# Altium project Power Supply.PrjPcb
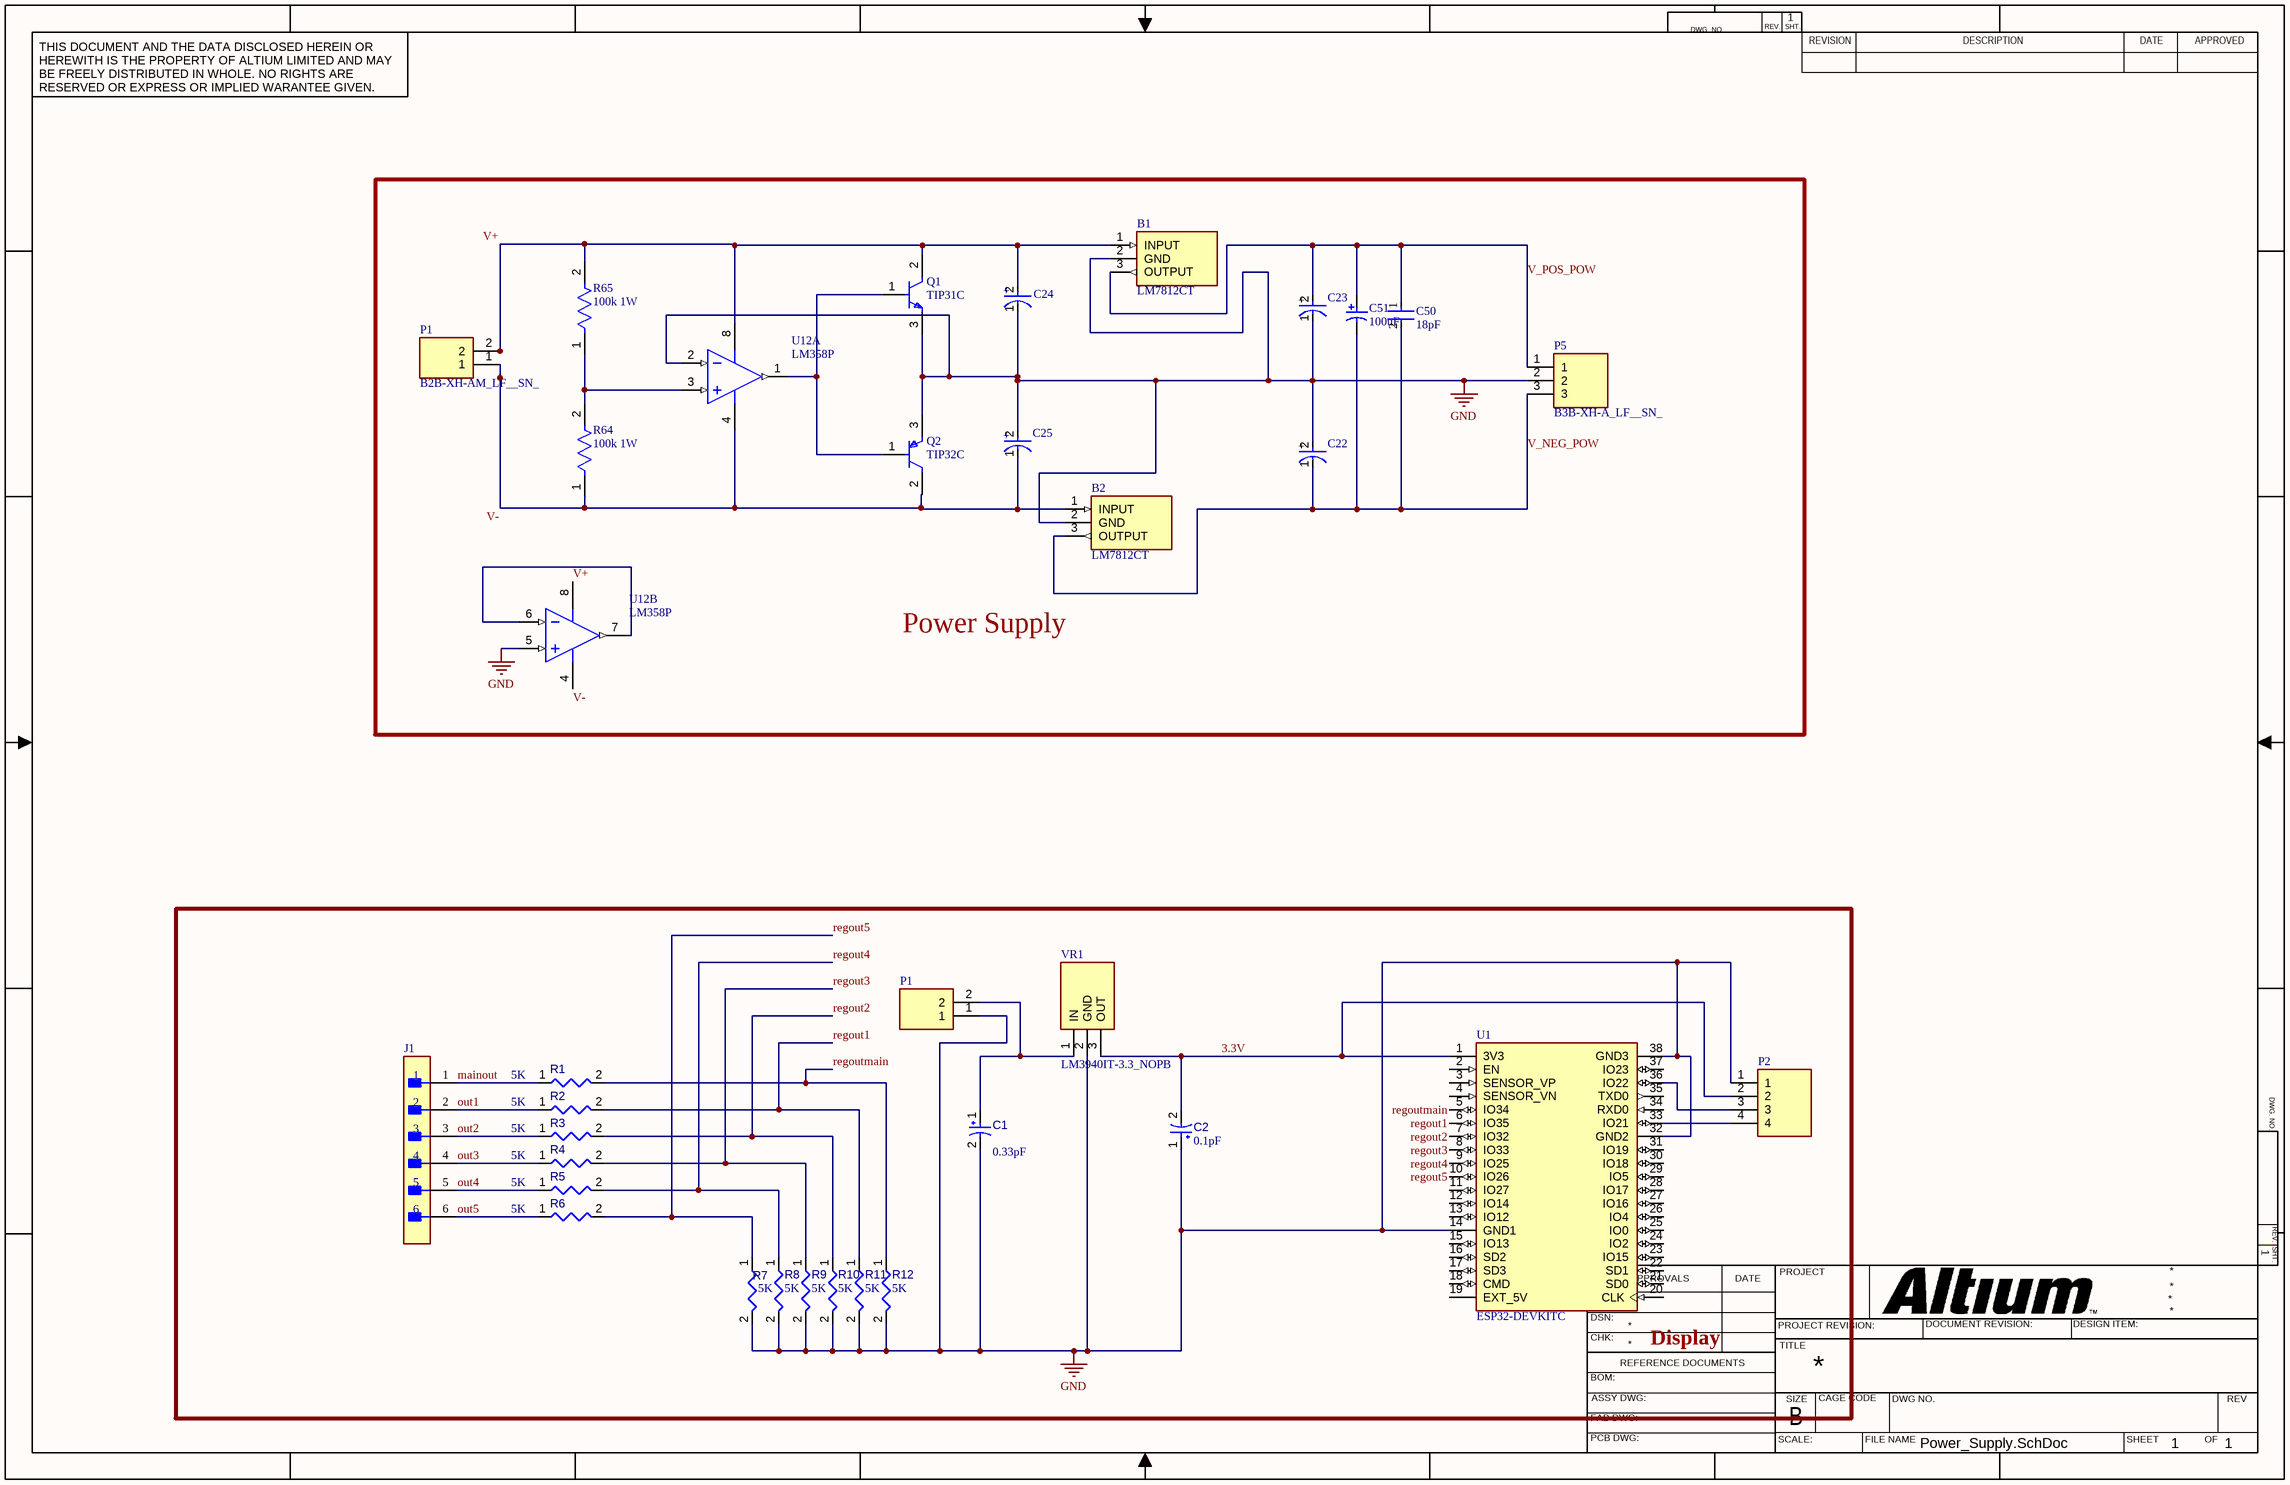
[diagram p0: Power_Supply.SchDoc]
1 sheet, 34 parts. Net scope: global (net labels, ports and power ports of the same name join across sheets).
Board file: PCB2.PcbDoc

## Sheet Power_Supply.SchDoc
size 431 x 279 mm; SheetNumber: 1; SheetTotal: 1

### Parts
(Parts that share a designator on the sheet are numbered #1, #2 ... from top to bottom, then left to right.)
B1  LM7812CT  [TO254P470X1028X1955-3P]
B2  LM7812CT  [TO254P470X1028X1955-3P]
C1  value 0.33pF  [CAPPR55-250-1120X630X1220]
C2  value 0.1pF  [CAPPR55-250-1120X630X1220]
C22  EEUFC1H4R7B  [FP-RAD-TH-D_5_0_5-L_11_1-MFG]  (value not drawn)
C23  EEUFC1H4R7B  [FP-RAD-TH-D_5_0_5-L_11_1-MFG]  (value not drawn)
C24  EEUFC1H4R7B  [FP-RAD-TH-D_5_0_5-L_11_1-MFG]  (value not drawn)
C25  EEUFC1H4R7B  [FP-RAD-TH-D_5_0_5-L_11_1-MFG]  (value not drawn)
C50  18pF  [FP-F471K33Y5RP6UK5R-MFG]
C51  100uF  [CAPPR65-350-1150X800X1250]
J1  B6B-XH-A(LF)(SN)  [FP-B6B-XH-A_LF_SN-MFG]  (value not drawn)
P1#1  B2B-XH-AM_LF__SN_  [B2BXHAMLFSN]
P1#2  B2B-XH-AM_LF__SN_  [B2BXHAMLFSN]  (value not drawn)
P2  (no value)  [B4BXHALFSN]
P5  B3B-XH-A_LF__SN_  [B3BXHALFSN]
Q1  TIP31C  [FP-TO-220-P0A0015988-MFG]
Q2  TIP32C  [FP-TO-220-P0A0015988-MFG]
R1  value 5K  [RESA60-630X240]  (hidden comment: MFR-25FBF52-221R)
R2  value 5K  [RESA60-630X240]  (hidden comment: MFR-25FBF52-221R)
R3  value 5K  [RESA60-630X240]  (hidden comment: MFR-25FBF52-221R)
R4  value 5K  [RESA60-630X240]  (hidden comment: MFR-25FBF52-221R)
R5  value 5K  [RESA60-630X240]  (hidden comment: MFR-25FBF52-221R)
R6  value 5K  [RESA60-630X240]  (hidden comment: MFR-25FBF52-221R)
R7  value 5K  [RESA60-630X240]  (hidden comment: MFR-25FBF52-221R)
R8  value 5K  [RESA60-630X240]  (hidden comment: MFR-25FBF52-221R)
R9  value 5K  [RESA60-630X240]  (hidden comment: MFR-25FBF52-221R)
R10  value 5K  [RESA60-630X240]  (hidden comment: MFR-25FBF52-221R)
R11  value 5K  [RESA60-630X240]  (hidden comment: MFR-25FBF52-221R)
R12  value 5K  [RESA60-630X240]  (hidden comment: MFR-25FBF52-221R)
R64  100k 1W  [FP-RR01-MFG]
R65  100k 1W  [FP-RR01-MFG]
U1  ESP32-DEVKITC  [MODULE_ESP32-DEVKITC]
U12  LM358P  [P0008A]  (parts A,B of 2)
VR1  LM3940IT-3.3_NOPB  [TO254P470X1028X1955-3P]

### Blocks framed on the sheet
Power Supply: B1 B2 C22-C25 C50 C51 P1#1 P5 Q1 Q2 R64 R65 U12
Display: C1 C2 J1 P1#2 P2 R1-R12 U1 VR1

### Nets
GND: B1.2(GND) B2.2(GND) C1.2 C2.1 C22.2(A) C23.1(C) C24.1(C) C25.2(A) P1#2.1 P2.1 P5.2 Q1.3(E) Q2.3(E) R7.2 R8.2 R9.2 R10.2 R11.2 R12.2 U1.14(GND1) U1.32(GND2) U1.38(GND3) U12.2(1IN-) U12.5(2IN+) VR1.2(GND)
3.3V: C2.2 P2.2 U1.1(3V3) VR1.3(OUT)
mainout: J1.1 R1.1
out1: J1.2 R2.1
out2: J1.3 R3.1
out3: J1.4 R4.1
out4: J1.5 R5.1
out5: J1.6 R6.1
regout1: R2.2 R11.1 U1.6(IO35)
regout2: R3.2 R10.1 U1.7(IO32)
regout3: R4.2 R9.1 U1.8(IO33)
regout4: R5.2 R8.1 U1.9(IO25)
regout5: R6.2 R7.1 U1.10(IO26)
regoutmain: R1.2 R12.1 U1.5(IO34)
V+: B1.1(INPUT) C24.2(A) P1#1.2 Q1.2(C) R65.2 U12.8(VCC)
V-: B2.1(INPUT) C25.1(C) P1#1.1 Q2.2(C) R64.1 U12.4(GND)
V_NEG_POW: B2.3(OUTPUT) C22.1(C) C50.2 C51.2 P5.3
V_POS_POW: B1.3(OUTPUT) C23.2(A) C50.1 C51.1 P5.1
NetC1_1: C1.1 P1#2.2 VR1.1(IN)
NetP2_3: P2.3 U1.36(IO22)
NetP2_4: P2.4 U1.33(IO21)
NetQ1_1: Q1.1(B) Q2.1(B) U12.1(1OUT)
NetR64_2: R64.2 R65.1 U12.3(1IN+)
NetU12_6: U12.6(2IN-) U12.7(2OUT)

Not connected (* = marked no-connect by the designer): U1 2(EN) 3(SENSOR_VP) 4(SENSOR_VN) 11(IO27) 12(IO14) 13(IO12) 15(IO13) 16(SD2) 17(SD3) 18(CMD) 19(EXT_5V) 20(CLK) 21(SD0) 22(SD1) 23(IO15) 24(IO2) 25(IO0) 26(IO4) 27(IO16) 28(IO17) 29(IO5) 30(IO18) 31(IO19) 34(RXD0) 35(TXD0) 37(IO23)

### Notes on the sheet
- DWG. NO.
- REV.
- SHT.
- THIS DOCUMENT AND THE DATA DISCLOSED HEREIN OR HEREWITH IS THE PROPERTY OF ALTIUM LIMITED AND MAY BE FREELY DISTRIBUTED IN WHOLE. NO RIGHTS ARE RESERVED OR EXPRESS OR IMPLIED WARANTEE GIVEN.
- REVISION
- DESCRIPTION
- DATE
- APPROVED
- ENG:
- APPROVALS
- PROJECT
- DSN:
- CHK:
- REFERENCE DOCUMENTS
- PROJECT REVISION:
- TITLE
- DOCUMENT REVISION:
- DESIGN ITEM:
- BOM:
- FAB DWG:
- PCB DWG:
- ASSY DWG:
- SCALE:
- SIZE
- B
- CAGE CODE
- FILE NAME
- DWG NO.
- SHEET
- OF
- REV
- (in symbol CMP-05427-000609-1) +

### Library data of the parts
B1 B2 = LM7812CT: Integrated Circuit; Manufacturer_Name: Texas Instruments; Datasheet Link: http://www.ti.com/lit/ds/symlink/lm7800.pdf; Height: 4.7mm; Manufacturer_Part_Number: LM7812CT; Mouser Part Number: 926-LM7812CT; Mouser Price/Stock: https://www.mouser.co.uk/ProductDetail/Texas-Instruments/LM7812CT?qs=QbsRYf82W3EQj7KGft8TFg%3D%3D
C1 C2 = CMP-001-00031-7: Aluminum Electrolytic Capacitor, 47 uF, +/-20%, 50 V, -40 to 85 degC, 2-Pin THD, RoHS, Bulk; Manufacturer: Panasonic; Ripple Current: 130mA; Voltage Rating: 50V; Tolerance: 20%; RoHS Compliant: True; Lead Pitch: 2.5mm; Packaging: Bulk; Case/Package: Radial; Diameter: 6.3mm; Datasheet Version: Apr-16; Mounting Technology: TH; Max Operating Temperature: 85°C; Package Quantity: 200; Package Description: 2-Pin Radial Lead, Dia 6.3 mm, Height 12.2 mm; Capacitor Type: Electrolytic; Min Operating Temperature: -40°C; Ripple Current (AC): 130mA; Manufacturer URL: http://www.panasonic.com/; Pins: 2; Datasheet URL: https://industrial.panasonic.com/cdbs/www-data/pdf/RDF0000/DMF0000COL72.pdf; Package Reference: CAPPR55-250-1120X630X1220
C22-C25 = CMP-05427-000609-1: Aluminum Electrolytic Capacitors (Radial Lead Type) AEC-Q200 Qualified 4.7uF ±20% 50V; Impedance: 1.3R; Life (Hours): 1000Hour; Polarity: Polar; Lead Diameter: 0.5mm; Ripple Current: 95mA; Ratings: AEC-Q200; Voltage Rating (DC): 50V; Voltage Rating: 50V; Lead Pitch: 5mm; Features: General Purpose; Height: 11mm; Radiation Hardening: No; Diameter: 5mm; Termination: Radial; Length: 11mm; Min Operating Temperature: -55°C; Height - Seated (Max): 0.472inch; Packaging: Tape and Reel; Max Operating Temperature: 105°C; ESR (Equivalent Series Resistance): 1.3R; RoHS Compliant: Yes; Package Quantity: 2000; Mount: Through Hole; Tolerance: 20%; Series: FC; Case/Package: Radial; Contact Plating: Tin
C50 = CMP-02417-000080-1: CAP CER 470PF 2KV Y5R RADIAL; Tolerance: 10%; Dielectric Material: Ceramic; Insulation Resistance: 10GR; Lead/Base Style: Kinked; Lead Diameter: 0.8mm; Series: F; Depth: 5mm; Package Quantity: 1500; Resistor Type: Ceramic; Construction: RADIAL; Min Operating Temperature: -30°C; Mount: Through Hole; Radiation Hardening: No; Voltage: 2kV; Voltage Rating: 2kV; Max Operating Temperature: 125°C; Termination: Radial; RoHS Compliant: Yes; Lead Pitch: 5mm; Capacitance: 470pF; Packaging: Tape and Reel; Length: 8.5mm; Case/Package: Radial; Dielectric: Y5R
C51 = CMP-1665-00042-2: Aluminum Electrolytic Capacitor, 100 uF, +/- 20%, 50 V, -40 to 85 degC, 2-Pin THD, RoHS, Bulk; Manufacturer: Panasonic; Lead Diameter: 0.6mm; Dielectric Material: Aluminium; Voltage Rating (DC): 50V; Ripple Current (AC): 250mA; Polarity: Polar; Leakage Current: 3uA; Life (Hours): 2000Hour; Lead/Base Style: Straight; Dissipation Factor: 0.12%; Radiation Hardening: No; Height: 11.5mm; Package Quantity: 200; Package Reference: CAPPR65-350-1150X800X1250; Min Operating Temperature: -40degC; Mount: ThroughHole; Package Description: 2-Pin Radial Lead, Dia 8 mm, Height 12.5 mm; Case/Package: Radial; Diameter: 8mm; Voltage Rating: 50V; Length: 11.5mm; REACH SVHC: NoSVHC; Height - Seated (Max): 0.492inch; Datasheet URL: https://industrial.panasonic.com/cdbs/www-data/pdf/RDF0000/ABA0000C1218.pdf; RoHSCompliant: true; Ripple Current: 250mA; Lead Free: LeadFree; Voltage: 50V; Manufacturer URL: http://www.panasonic.com/; Number of Pins: 2; Datasheet Version: Rev. 05, 10/2016; Packaging: Bulk; Termination: Radial; Max Operating Temperature: 85degC; Tolerance: 20%; Capacitance: 100uF; Lead Pitch: 3.5mm
J1 = CMP-17439-000076-1: CONN HEADER VERT 6POS 2.5MM
P1#1 P1#2 = B2B-XH-AM_LF__SN_: Connector; Manufacturer_Name: JST (JAPAN SOLDERLESS TERMINALS); Manufacturer_Part_Number: B2B-XH-AM(LF)(SN); Datasheet Link: https://www.jst-mfg.com/product/pdf/eng/eXH.pdf; Height: 7mm; Arrow Part Number: B2B-XH-AM(LF)(SN); Arrow Price/Stock: https://www.arrow.com/en/products/b2b-xh-am-lf-sn/jst-manufacturing?region=europe
P2 = B4B-XH-A_LF__SN_: Connector; Manufacturer_Name: JST (JAPAN SOLDERLESS TERMINALS); Manufacturer_Part_Number: B4B-XH-A(LF)(SN); Datasheet Link: https://datasheet.lcsc.com/szlcsc/JST-Sales-America-B4B-XH-A-LF-SN_C144395.pdf; Height: 7mm; Arrow Part Number: B4B-XH-A(LF)(SN); Arrow Price/Stock: https://www.arrow.com/en/products/b4b-xh-a-lf-sn/jst-manufacturing?region=europe
P5 = B3B-XH-A_LF__SN_: Connector; Manufacturer_Name: JST (JAPAN SOLDERLESS TERMINALS); Manufacturer_Part_Number: B3B-XH-A(LF)(SN); Datasheet Link: https://datasheet.lcsc.com/szlcsc/1812131720_JST-Sales-America-B3B-XH-A-LF-SN_C144394.pdf; Height: 7mm; Arrow Part Number: B3B-XH-A(LF)(SN); Arrow Price/Stock: https://www.arrow.com/en/products/b3b-xh-a-lf-sn/jst-manufacturing?region=europe
Q1 = CMP-12195-000001-1: TRANS NPN 100V 3A TO-220; Manufacturer: STMicroelectronics; Hfe Max: 50; Number Of Npn: 1; Max Junction Temp: +150°C; Standoff Height: 3.5mm; Emitter Base Voltage: 5V; Collector Emitter Saturation Voltage: 1.2V; Power Dissipation: 2W; Hfe Testvce: 4V; Hfe Min: 10; Device Class L2: Transistors; ComponentLink2URL: https://www.st.com/resource/en/datasheet/tip31c.pdf; Device Class L1: Discrete Semiconductors; Digikey Description: TRANS NPN 100V 3A TO-220; Max Collector Current: 3A; RoHS: TRUE; Height: 19.68mm; Mouser Description: Bipolar Transistors - BJT NPN Gen Pur Power; Number Of Elements: 1; Package: TO-220-P0A0015988; Temperature: to +150°C; Octopart: https://octopart.com/tip31c-stmicroelectronics-15555; Manufacturer Part Number: TIP31C; Category: Trans; Hfe Testic: 3A; Lead Free: Yes; Collector Base Voltage: 100V; Device Class L3: BJTs; Collector Emitter Voltage: 100V; Automotive: No; ComponentLink2Description: Datasheet; Temperature Range High: +150°C
Q2 = CMP-12195-000005-1: TRANS PNP 100V 3A TO-220; Manufacturer: STMicroelectronics; Standoff Height: 3.5mm; Number Of Pnp: 1; Max Collector Current: -3A; Emitter Base Voltage: -5V; Collector Emitter Voltage: -100V; Hfe Testvce: -4V; Hfe Max: 50; Collector Emitter Saturation Voltage: -1.2V; Power Dissipation: 2W; Max Junction Temp: +150°C; Hfe Min: 10; Device Class L3: BJTs; Mouser Description: Original ST Microelectronics Transistor, 100V, 3A, .22 Ohm, TO-220 Package; ComponentLink2Description: Datasheet; Device Class L1: Discrete Semiconductors; Automotive: No; Number Of Elements: 1; Category: Trans; Collector Base Voltage: -100V; Package: TO-220-P0A0015988; Height: 19.68mm; Lead Free: Yes; ComponentLink2URL: https://www.st.com/resource/en/datasheet/tip32c.pdf; Hfe Testic: -3A; RoHS: TRUE; Temperature Range High: +150°C; Temperature: to +150°C; Device Class L2: Transistors; Digikey Description: TRANS PNP 100V 3A TO-220; Octopart: https://octopart.com/tip32c-stmicroelectronics-353617; Manufacturer Part Number: TIP32C
R1-R12 = CMP-009-00051-4: Manufacturer: Yageo; Tolerance: 1%; Power: 250mW; Voltage Rating: 250V; RoHS Compliant: True; Mounting Technology: TH; Max Operating Temperature: 155°C; Min Operating Temperature: -55°C; Case/Package: Axial; Package Quantity: 200; Manufacturer URL: http://www.yageo.com/; Package Reference: MFR-25; Datasheet URL: http://www.yageo.com/documents/recent/Yageo%20LR_MFR_2013.pdf; Packaging: Bulk; Package Description: 2-Pin Axial Lead, Dia 2.4 mm, Body Length 6.3 mm; Datasheet Version: Apr-13
R64 R65 = CMP-03212-000008-1: RES 100K OHM 5% 1W AXIAL; Number of Resistors: 1; Temperature Coefficient: 300ppm/°C; Voltage Rating: 350V; Resistance: 100kR; Package Quantity: 5000; Power Rating: 1W; Packaging: Ammo Pack; Min Operating Temperature: -55°C; Number of Terminations: 2; Resistor Type: Power resistor; Length: 6.8mm; ELV: Compliant; Mount: Axial; RoHS Compliant: Yes; Case/Package: Metal; Diameter: 2.6mm; Termination: Axial; Series: RR; Max Operating Temperature: 155°C; Tolerance: 5%
U1 = CMP-035-000000-1: ESP32-WROOM-32UE series Transceiver; 802.11 b/g/n (Wi-Fi, WiFi, WLAN), Bluetooth Â® Smart Ready 4.x Dual Mode Evaluation Board; MF: Espressif Systems; Pin Count: 38; Availability: In Stock; Price: None; Source: ESP32-DEVKITC.SchLib; SnapEDA_Link: https://www.snapeda.com/parts/ESP32-DEVKITC/Espressif+Systems/view-part/?ref=snap; Design Item ID: ESP32-DEVKITC; Check_prices: https://www.snapeda.com/parts/ESP32-DEVKITC/Espressif+Systems/view-part/?ref=eda; Component Type: Standard; Value: *; Package: None; Purchase-URL: https://pricing.snapeda.com/search/part/ESP32-DEVKITC/?ref=eda; MP: ESP32-DEVKITC
U12 = CMP-2000-06549-1: Dual Operational Amplifier, 3 to 32 V, 0 to 70 degC, 8-Pin PDIP (P), RoHS, Tape and Reel; Manufacturer: Technik Industrial; Datasheet Version: Rev. T, 04/2015; Datasheet URL: http://www.ti.com/lit/ds/symlink/lm358.pdf; Manufacturer URL: http://www.technik.com.hk/; Package Description: 8-Pin Double In-line Package, Body 9.59 x 6.35 mm, Pitch 2.54 mm; Mounting Technology: ThroughHole; Package URL: http://www.ti.com/lit/ml/mpdi001b/mpdi001b.pdf; Package Reference: P8
VR1 = LM3940IT-3.3_NOPB: Integrated Circuit; Manufacturer_Name: Texas Instruments; Manufacturer_Part_Number: LM3940IT-3.3/NOPB; Datasheet Link: http://www.ti.com/general/docs/lit/getliterature.tsp?genericPartNumber=LM3940&&fileType=pdf; Height: 4.7mm; Mouser Part Number: 926-LM3940IT-3.3NOPB; Mouser Price/Stock: https://www.mouser.co.uk/ProductDetail/Texas-Instruments/LM3940IT-3.3-NOPB?qs=QbsRYf82W3FGrjqcSAbcdA%3D%3D; Arrow Part Number: LM3940IT-3.3/NOPB; Arrow Price/Stock: https://www.arrow.com/en/products/lm3940it-3.3nopb/texas-instruments?region=nac